# EasyEDA Pro project ProProject_四足舵机控制板V2-PCA9685_2024-05-28.epro, board AS01-SPIPX-V3.0_1
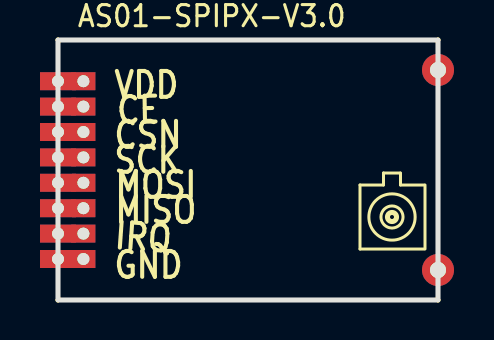
[diagram p1: board, top side]
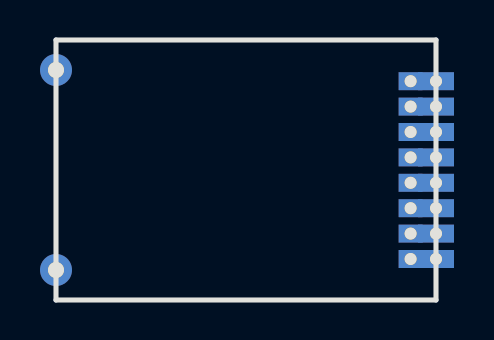
[diagram p2: board, bottom side, seen from below]

Outline 19 x 13 mm; copper layers: Top Layer, Bottom Layer. Coordinates in mm from the lower left corner of the outline.
Outline path: 0,13 19,13 19,0 0,0 0,13
Stack: SUBSTRATE1 0.32mm FR-4 er 4.8 / Bottom Layer 0.035mm

## Design rules (mm)
spacing safeClearance (default): track to track 0.152, other pairs 0.152 to 0.3
track width trackWidth (default): min 0.127, default 0.254, max 2.54
differential pair differentialPair (default): width min 0.127, default 0.254, max 2.54; gap min 0.152, default 0.152
via viaSize (default): diameter min 0.5, default 0.61, max 10; hole min 0.3, default 0.305, max 6

## Placement (name value [footprint] x y rotation side)
AS01-SPIPX-V3.0  -  [CON8-2X1.27MM]  0 10.94 0 top
NOREF  -  [Pad_ie21]  19 1.5 0 top
NOREF#2  -  [Pad_ie20]  19 11.5 0 top

## Footprints (pads in the part's own frame, mm; a bottom-side part is the same pattern mirrored in y, then rotated)
CON8-2X1.27MM
  rect 1.8x0.9 hole 0.6: 1(0,0) 2(0,-1.27) 3(0,-2.54) 4(0,-3.81) 5(0,-5.08) 6(0,-6.35) 7(0,-7.62) 8(0,-8.89)
  rect 1.2x0.9 hole 0.6: 1(1.27,0) 2(1.27,-1.27) 3(1.27,-2.54) 4(1.27,-3.81) 5(1.27,-5.08) 6(1.27,-6.35) 7(1.27,-7.62) 8(1.27,-8.89)
Pad_ie20
  round 1.6 hole 0.8: 0(0,0)
Pad_ie21
  round 1.6 hole 0.8: 0(0,0)

## Nets

Pads without a net: AS01-SPIPX-V3.0 1 2 3 4 5 6 7 8; NOREF 0; NOREF#2 0

## Text on the board
Top Silkscreen Layer: VDD | CSN | SCK | GND | MOSI | MISO | CE | IRQ
